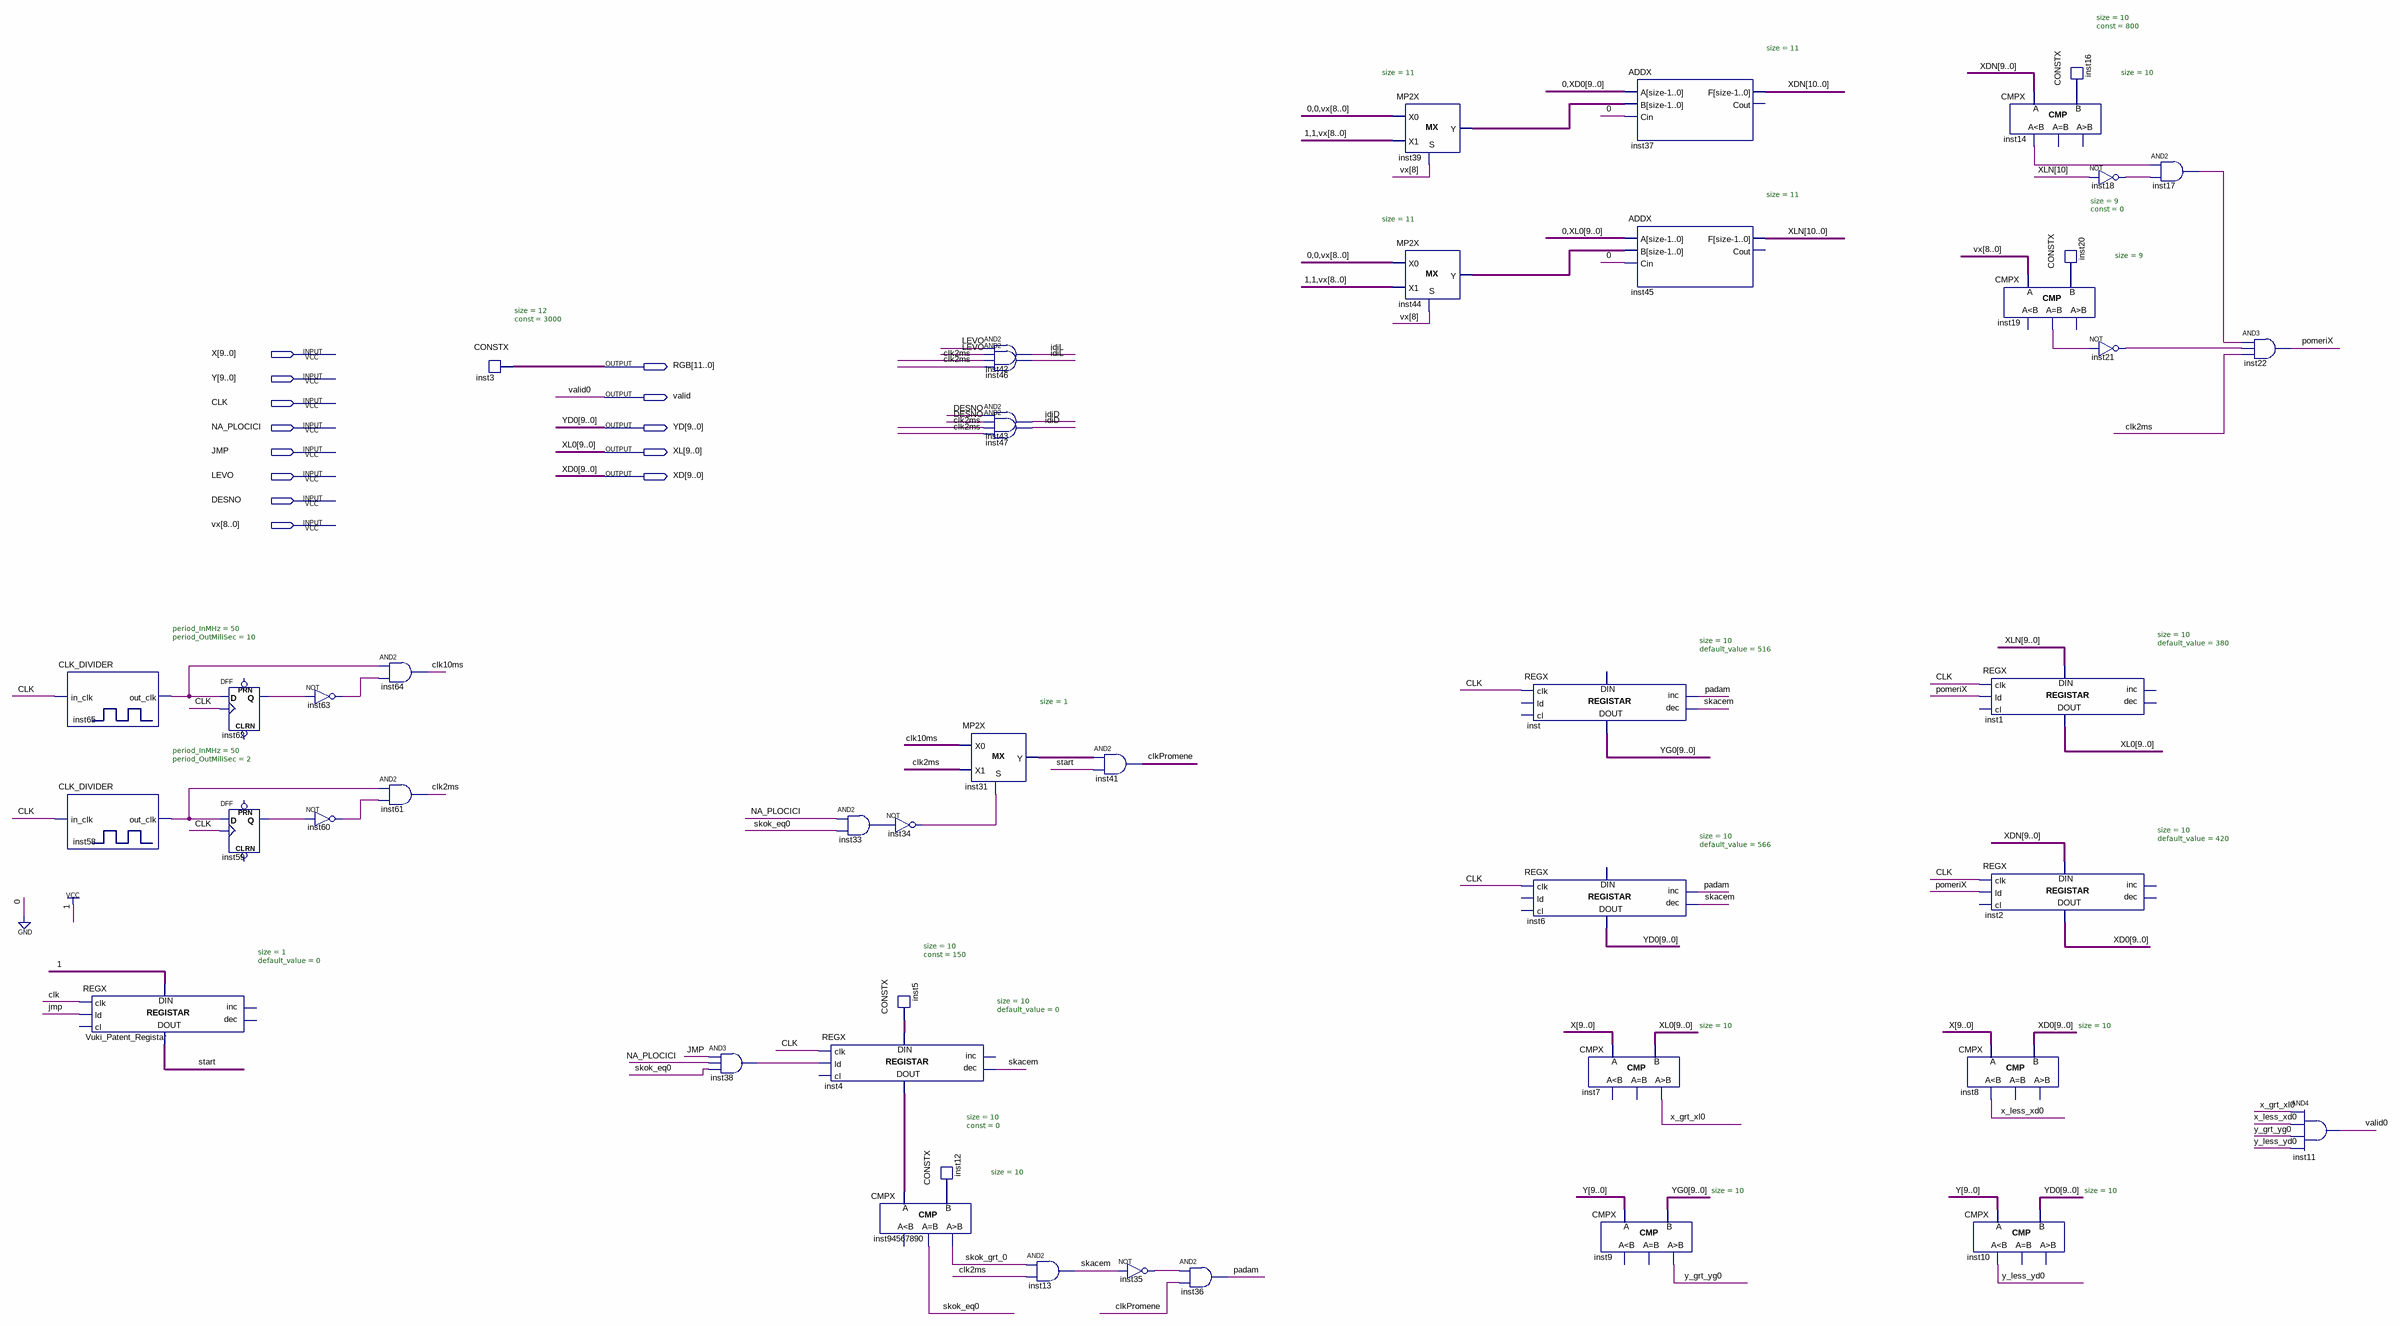
[diagram p0: schematic sheet]
// Quartus schematic cikica.bdf as structural Verilog: 47 symbols, 13 pins
module cikica (
  input  [9:0] X,
  input  [9:0] Y,
  input  CLK,
  input  NA_PLOCICI,
  input  JMP,
  input  LEVO,
  input  DESNO,
  input  [8:0] vx,
  output [11:0] RGB,
  output valid,
  output [9:0] YD,
  output [9:0] XL,
  output [9:0] XD
);

  wire clk2ms, clk10ms, clkPromene, idiD, idiL, inst14_ls, inst17_out, inst18_out, inst19_eq, inst21_out,
       inst31_y, inst33_out, inst34_out, inst35_out, inst38_out, inst58_out_clk, inst59_q, inst60_out,
       inst62_q, inst63_out, inst65_out_clk, padam, pomeriX, skacem, skok_eq0, skok_grt_0, start, x_grt_xl0,
       x_less_xd0, y_grt_yg0, y_less_yd0;
  wire [8:0] inst20_data;
  wire [9:0] inst4_data_out, inst5_data, inst12_data, inst16_data, YG0;
  wire [10:0] inst39_y, inst44_y, XDN, XLN;

  CLK_DIVIDER #(.period_InMHz(50), .period_OutMiliSec(10)) inst65 (.in_clk(CLK), .out_clk(inst65_out_clk));
  CLK_DIVIDER #(.period_InMHz(50), .period_OutMiliSec(2)) inst58 (.in_clk(CLK), .out_clk(inst58_out_clk));
  REGX #(.size(1), .default_value(0)) Vuki_Patent_Registar (
    .clk(CLK), .ld(JMP), .data_in(1'b1), .data_out(start));  // open: cl, inc, dec
  DFF inst62 (.CLK(CLK), .D(inst65_out_clk), .Q(inst62_q));  // open: CLRN, PRN
  DFF inst59 (.CLK(CLK), .D(inst58_out_clk), .Q(inst59_q));  // open: CLRN, PRN
  not inst63 (inst63_out, inst62_q);
  not inst60 (inst60_out, inst59_q);
  and inst64 (clk10ms, inst65_out_clk, inst63_out);
  and inst61 (clk2ms, inst58_out_clk, inst60_out);
  CONSTX #(.size(12), .\const (3000)) inst3 (.data(RGB));
  and inst38 (inst38_out, JMP, NA_PLOCICI, skok_eq0);
  REGX #(.size(10), .default_value(0)) inst4 (
    .clk(CLK), .ld(inst38_out), .dec(skacem), .data_in(inst5_data), .data_out(inst4_data_out));  // open: cl, inc
  and inst33 (inst33_out, NA_PLOCICI, skok_eq0);
  CMPX #(.size(10)) inst94567890 (.A(inst4_data_out), .B(inst12_data), .eq(skok_eq0), .gr(skok_grt_0));  // open: ls
  not inst34 (inst34_out, inst33_out);
  CONSTX #(.size(10), .\const (150)) inst5 (.data(inst5_data));
  MP2X #(.size(1)) inst31 (.S(inst34_out), .X0(clk10ms), .X1(clk2ms), .Y(inst31_y));
  CONSTX #(.size(10), .\const (0)) inst12 (.data(inst12_data));
  and inst42 (idiL, LEVO, clk2ms);
  and inst46 (idiL, LEVO, clk2ms);
  and inst43 (idiD, DESNO, clk2ms);
  and inst47 (idiD, DESNO, clk2ms);
  and inst13 (skacem, skok_grt_0, clk2ms);
  and inst41 (clkPromene, inst31_y, start);
  not inst35 (inst35_out, skacem);
  and inst36 (padam, inst35_out, clkPromene);
  MP2X #(.size(11)) inst39 (.S(vx[8]), .X0({2'b00, vx}), .X1({2'b11, vx}), .Y(inst39_y));
  MP2X #(.size(11)) inst44 (.S(vx[8]), .X0({2'b00, vx}), .X1({2'b11, vx}), .Y(inst44_y));
  REGX #(.size(10), .default_value(516)) inst (
    .clk(CLK), .inc(padam), .dec(skacem), .data_out(YG0));  // open: ld, cl, data_in
  REGX #(.size(10), .default_value(566)) inst6 (
    .clk(CLK), .inc(padam), .dec(skacem), .data_out(YD));  // open: ld, cl, data_in
  CMPX #(.size(10)) inst7 (.A(X), .B(XL), .gr(x_grt_xl0));  // open: ls, eq
  CMPX #(.size(10)) inst9 (.A(Y), .B(YG0), .gr(y_grt_yg0));  // open: ls, eq
  ADDX #(.size(11)) inst37 (.A({1'b0, XD}), .B(inst39_y), .Cin(1'b0), .F(XDN));  // open: Cout
  ADDX #(.size(11)) inst45 (.A({1'b0, XL}), .B(inst44_y), .Cin(1'b0), .F(XLN));  // open: Cout
  CMPX #(.size(9)) inst19 (.A(vx), .B(inst20_data), .eq(inst19_eq));  // open: ls, gr
  REGX #(.size(10), .default_value(380)) inst1 (
    .clk(CLK), .ld(pomeriX), .data_in(XLN[9:0]), .data_out(XL));  // open: cl, inc, dec
  REGX #(.size(10), .default_value(420)) inst2 (
    .clk(CLK), .ld(pomeriX), .data_in(XDN[9:0]), .data_out(XD));  // open: cl, inc, dec
  CMPX #(.size(10)) inst8 (.A(X), .B(XD), .ls(x_less_xd0));  // open: eq, gr
  CMPX #(.size(10)) inst10 (.A(Y), .B(YD), .ls(y_less_yd0));  // open: eq, gr
  CMPX #(.size(10)) inst14 (.A(XDN[9:0]), .B(inst16_data), .ls(inst14_ls));  // open: eq, gr
  CONSTX #(.size(10), .\const (800)) inst16 (.data(inst16_data));
  not inst18 (inst18_out, XLN[10]);
  CONSTX #(.size(9), .\const (0)) inst20 (.data(inst20_data));
  not inst21 (inst21_out, inst19_eq);
  and inst17 (inst17_out, inst14_ls, inst18_out);
  and inst22 (pomeriX, inst17_out, inst21_out, clk2ms);
  and inst11 (valid, x_grt_xl0, x_less_xd0, y_grt_yg0, y_less_yd0);

  // Other names for the same wires on the sheet: valid0 = valid; XD0[9:0] = XD; XL0[9:0] = XL; YD0[9:0] = YD
endmodule
